# EAGLE schematic LEbalunfeed (EAGLE 9.5.0)
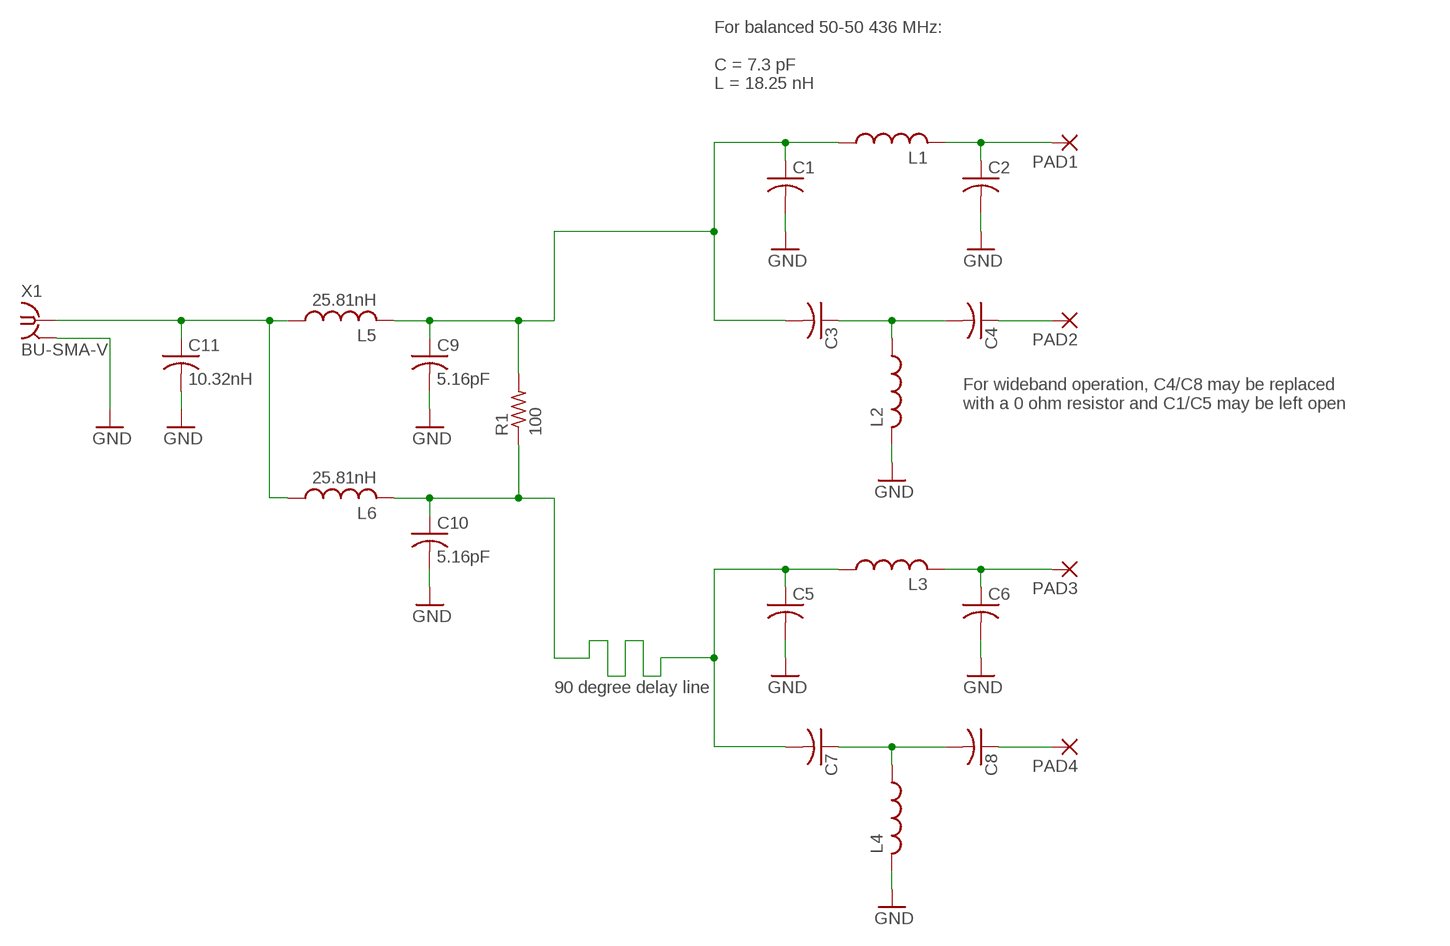
[diagram p0: schematic, sheet 1]

## Parts
C1  C-USC1608  [C1608]
C2  C-USC1608  [C1608]
C3  C-USC1608  [C1608]
C4  C-USC1608  [C1608]
C5  C-USC1608  [C1608]
C6  C-USC1608  [C1608]
C7  C-USC1608  [C1608]
C8  C-USC1608  [C1608]
C9  5.16pF  C-USC1608  [C1608]
C10  5.16pF  C-USC1608  [C1608]
C11  10.32nH  C-USC1608  [C1608]
L1  L-USL2012C  [L2012C]
L2  L-USL2012C  [L2012C]
L3  L-USL2012C  [L2012C]
L4  L-USL2012C  [L2012C]
L5  25.81nH  L-USL2012C  [L2012C]
L6  25.81nH  L-USL2012C  [L2012C]
PAD1  0  ANTENNAPAD2  [CMMOUNTPAD2]
PAD2  180  ANTENNAPAD2  [CMMOUNTPAD2]
PAD3  90  ANTENNAPAD2  [CMMOUNTPAD2]
PAD4  270  ANTENNAPAD2  [CMMOUNTPAD2]
R1  100  R-US_R2012  [R2012]
X1  BU-SMA-V  [BU-SMA-V]

## Nets
GND: C1.2 C2.2 C5.2 C6.2 C9.2 C10.2 C11.2 L2.2 L4.2 X1.2 X1.3 X1.4 X1.5
N$1: C2.1 L1.2 PAD1.P$1(P)
N$2: C3.1 C4.2 L2.1
N$3: C4.1 PAD2.P$1(P)
N$4: C1.1 C3.2 C9.1 L1.1 L5.2 R1.2
N$5: C6.1 L3.2 PAD3.P$1(P)
N$6: C7.1 C8.2 L4.1
N$7: C8.1 PAD4.P$1(P)
N$9: C11.1 L5.1 L6.1 X1.1
N$11: C5.1 C7.2 C10.1 L3.1 L6.2 R1.1

## Notes on the sheet
- For balanced 50-50 436 MHz:
  
  C = 7.3 pF
  L = 18.25 nH
- For wideband operation, C4/C8 may be replaced 
  with a 0 ohm resistor and C1/C5 may be left open
- 90 degree delay line

## Library data of the parts
C1-C11 = resistor:C-US: CAPACITOR, American symbol
L1-L6 = rcl:L-US: INDUCTOR, American symbol
PAD1-PAD4 = AntennaPad:ANTENNAPAD2
R1 = resistor:R-US_: RESISTOR, American symbol
X1 = con-coax:BU-SMA-V: FEMALE SMA CONNECTOR Radiall distributor RS 112-3794; OC_FARNELL: unknown; OC_NEWARK: unknown